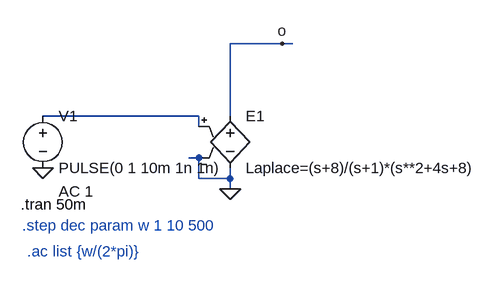
[diagram p0: schematic laplace_ac_anglefrequency.asc]
laplace_ac_anglefrequency.asc, the LTspice schematic file:
Version 4
SHEET 1 880 680
WIRE 128 48 48 48
WIRE 144 48 128 48
WIRE 0 160 -240 160
WIRE 48 160 48 48
WIRE 0 176 0 160
WIRE 0 224 -16 224
WIRE 0 256 0 224
WIRE 48 256 48 240
WIRE 48 256 0 256
WIRE 48 272 48 256
FLAG 48 272 0
FLAG -240 240 0
FLAG 128 48 o
SYMBOL e 48 144 R0
SYMATTR InstName E1
SYMATTR Value Laplace=(s+8)/(s+1)*(s**2+4s+8)
SYMBOL voltage -240 144 R0
WINDOW 123 24 132 Left 0
WINDOW 39 0 0 Left 0
SYMATTR InstName V1
SYMATTR Value PULSE(0 1 10m 1n 1n)
SYMATTR Value2 AC 1
TEXT -274 296 Left 0 !.tran 50m
TEXT -272 328 Left 0 ;.step dec param w 1 10 500
TEXT -264 368 Left 0 ;.ac list {w/(2*pi)}

The netlist it stands for:
* laplace_ac_anglefrequency.asc
E1 o 0 N001 0 Laplace=(s+8)/(s+1)*(s**2+4s+8)
V1 N001 0 PULSE(0 1 10m 1n 1n) AC 1
.tran 50m
* .step dec param w 1 10 500
* .ac list {w/(2*pi)}
.backanno
.end